# Altium schematic sheet SMA Single Filter.SchDoc: SMA Inline Filter
size A4; SheetNumber: 1; SheetTotal: 1
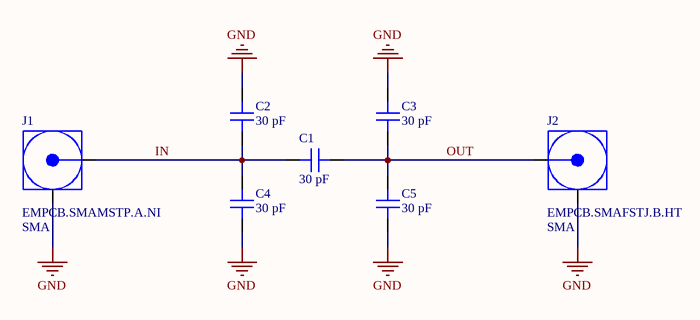
[diagram p0: SMA Single Filter.SchDoc]

## Parts
C1  30 pF  [CAP 0402_1005]
C2  30 pF  [CAP 0402_1005]
C3  30 pF  [CAP 0402_1005]
C4  30 pF  [CAP 0402_1005]
C5  30 pF  [CAP 0402_1005]
J1  EMPCB.SMAMSTP.A.NI  Connector Style: SMA  [TAOGLAS EMPCB.SMAMSTP.A.NI]
J2  EMPCB.SMAFSTJ.B.HT  Connector Style: SMA  [TAOGLAS EMPCB.SMAFSTJ.B.HT]

## Nets
GND: C2.2 C3.2 C4.1 C5.1 J1.G(GND) J2.G(GND)
IN: C1.1 C2.1 C4.2 J1.S(Signal)
OUT: C1.2 C3.1 C5.2 J2.S(Signal)

## Notes on the sheet
- Title
- Size:
- Date:
- A4
- Number:
- Time:
- Revision:
- Sheet
- of
- File:

## Library data of the parts
C1-C5 = QCCF251Q300J1GV001T: HIGH-Q MLC CAPACITOR, C-SERIES,; manufacturer: Johanson Technology Inc.; Temperature Coefficient: C0G, NP0; Tolerance: ±5%; Voltage - Rated: 250V; Part Number: QCCF251Q300J1GV001T; Value: 30 pF; Applications: RF, Microwave, High Frequency; Capacitance: 30 pF; componentlink2description: DigiKey Link; componentlink2url: https://www.digikey.com/en/products/detail/johanson-technology-inc/QCCF251Q300J1GV001T/13542793; Device Package: 0402 (1005 Metric); Features: High Q, Low Loss; lastupdated: 29/10/2023 19:03:48; Lifecycle Status: Active; Minimum Order: 10000; Mounting Type: Surface Mount, MLCC; Operating Temperature: -55°C ~ 150°C; Package / Case: 0402 (1005 Metric); packaging: TapeAndReel; partid: 45268; Part Status: Active; price: 0.03; series: C; Size / Dimension: 0.040" L x 0.020" W (1.02mm x 0.51mm); Supplier 1: DigiKey; Supplier Part Number 1: 712-QCCF251Q300J1GV001TCT-ND; Thickness (Max): 0.024" (0.61mm)
J1 = EMPCB.SMAMSTP.A.NI: SMA(M)ST FOR PCB EDGE MOUNT NI P; Manufacturer: Taoglas Limited; Connector Type: Plug, Male Pin; Contact Termination: Solder; Number of Ports: 1; Part Number: EMPCB.SMAMSTP.A.NI; ComponentLink1Description: Datasheet; ComponentLink1URL: https://www.taoglas.com/datasheets/ConnectorCatalogue.pdf; ComponentLink2Description: DigiKey Link; ComponentLink2URL: https://www.digikey.com/en/products/detail/taoglas-limited/EMPCB-SMAMSTP-A-NI/15998679; Fastening Type: Threaded; Housing Color: Silver; LastUpdated: 27/10/2023 11:13:02; Lifecycle Status: Active; Minimum Order: 1; Mounting Type: Board Edge, End Launch; Packaging: Bag; Price: 3.41; Series: -; Shield Termination: Solder; Supplier 1: DigiKey; Supplier Part Number 1: 931-EMPCB.SMAMSTP.A.NI-ND
J2 = EMPCB.SMAFSTJ.B.HT: CONN SMA JACK STR 50OHM EDGE MNT; Manufacturer: Taoglas Limited; Connector Type: Jack, Female Socket; Contact Termination: Solder; Frequency - Max: 12.4 GHz; Impedance: 50 Ohms; Number of Ports: 1; Part Number: EMPCB.SMAFSTJ.B.HT; ComponentLink1Description: Datasheet; ComponentLink1URL: https://cdn.taoglas.com/datasheets/EMPCB.SMAFSTJ.B.HT.pdf; ComponentLink2Description: DigiKey Link; ComponentLink2URL: https://www.digikey.com/en/products/detail/taoglas-limited/EMPCB-SMAFSTJ-B-HT/3522337; Fastening Type: Threaded; Housing Color: Gold; LastUpdated: 27/10/2023 11:14:18; Lifecycle Status: Active; Minimum Order: 1; Mounting Type: Board Edge, End Launch; Packaging: Tray; Part Status: Active; Price: 2.86; Series: -; Shield Termination: Solder; Supplier 1: DigiKey; Supplier Part Number 1: 931-1175-ND